# Altium project DIY_BLE_Keyboard.PrjPcb
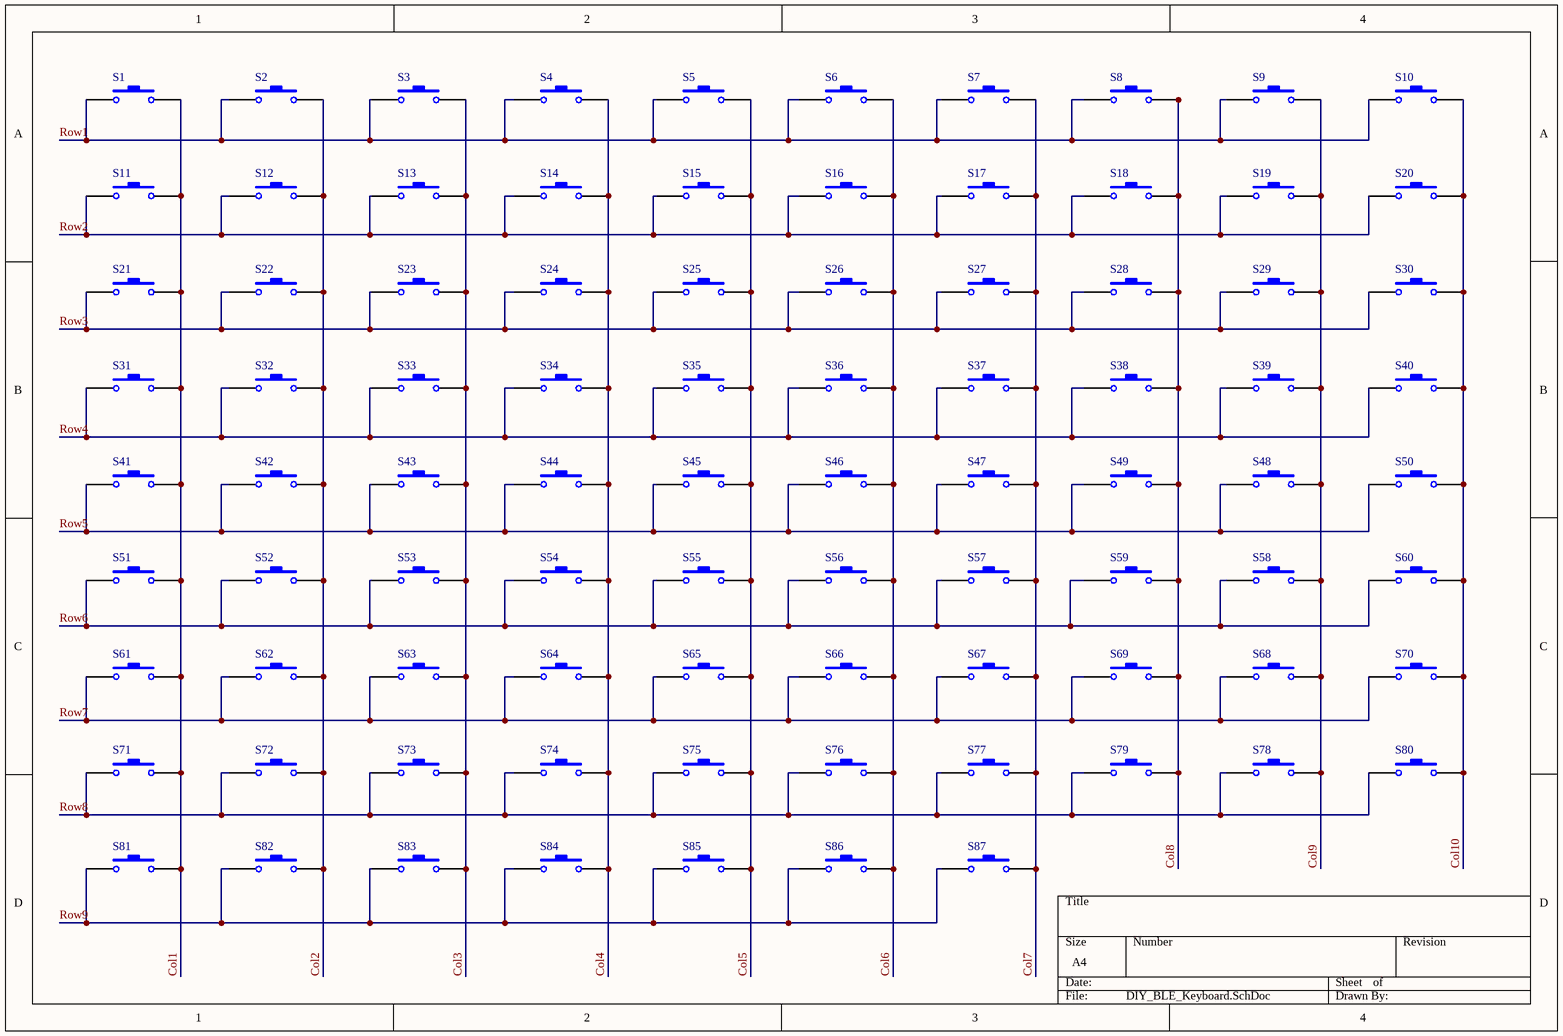
[diagram p0: DIY_BLE_Keyboard.SchDoc]
2 sheets, 119 parts. Net scope: global (net labels, ports and power ports of the same name join across sheets).
Board file: BLE_KB.PcbDoc
Sheets:
  DIY_BLE_Keyboard.SchDoc
  BLE_MCU.SchDoc

## Sheet DIY_BLE_Keyboard.SchDoc
size A4

### Parts
S1  SW-PB  [MX_SW-4]  (value not drawn)
S2  SW-PB  [MX_SW-4]  (value not drawn)
S3  SW-PB  [MX_SW-4]  (value not drawn)
S4  SW-PB  [MX_SW-4]  (value not drawn)
S5  SW-PB  [MX_SW-4]  (value not drawn)
S6  SW-PB  [MX_SW-4]  (value not drawn)
S7  SW-PB  [MX_SW-4]  (value not drawn)
S8  SW-PB  [MX_SW-4]  (value not drawn)
S9  SW-PB  [MX_SW-4]  (value not drawn)
S10  SW-PB  [MX_SW-4]  (value not drawn)
S11  SW-PB  [MX_SW-4]  (value not drawn)
S12  SW-PB  [MX_SW-4]  (value not drawn)
S13  SW-PB  [MX_SW-4]  (value not drawn)
S14  SW-PB  [MX_SW-4]  (value not drawn)
S15  SW-PB  [MX_SW-4]  (value not drawn)
S16  SW-PB  [MX_SW-4]  (value not drawn)
S17  SW-PB  [MX_SW-4]  (value not drawn)
S18  SW-PB  [MX_SW-4]  (value not drawn)
S19  SW-PB  [MX_SW-4]  (value not drawn)
S20  SW-PB  [MX_SW-4]  (value not drawn)
S21  SW-PB  [MX_SW-4]  (value not drawn)
S22  SW-PB  [MX_SW-4]  (value not drawn)
S23  SW-PB  [MX_SW-4]  (value not drawn)
S24  SW-PB  [MX_SW-4]  (value not drawn)
S25  SW-PB  [MX_SW-4]  (value not drawn)
S26  SW-PB  [MX_SW-4]  (value not drawn)
S27  SW-PB  [MX_SW-4]  (value not drawn)
S28  SW-PB  [MX_SW-4]  (value not drawn)
S29  SW-PB  [MX_SW-4]  (value not drawn)
S30  SW-PB  [MX_SW-4]  (value not drawn)
S31  SW-PB  [MX_SW-4]  (value not drawn)
S32  SW-PB  [MX_SW-4]  (value not drawn)
S33  SW-PB  [MX_SW-4]  (value not drawn)
S34  SW-PB  [MX_SW-4]  (value not drawn)
S35  SW-PB  [MX_SW-4]  (value not drawn)
S36  SW-PB  [MX_SW-4]  (value not drawn)
S37  SW-PB  [MX_SW-4]  (value not drawn)
S38  SW-PB  [MX_SW-4]  (value not drawn)
S39  SW-PB  [MX_SW-4]  (value not drawn)
S40  SW-PB  [MX_SW-4]  (value not drawn)
S41  SW-PB  [MX_SW-4]  (value not drawn)
S42  SW-PB  [MX_SW-4]  (value not drawn)
S43  SW-PB  [MX_SW-4]  (value not drawn)
S44  SW-PB  [MX_SW-4]  (value not drawn)
S45  SW-PB  [MX_SW-4]  (value not drawn)
S46  SW-PB  [MX_SW-4]  (value not drawn)
S47  SW-PB  [MX_SW-4]  (value not drawn)
S48  SW-PB  [MX_SW-4]  (value not drawn)
S49  SW-PB  [MX_SW-4]  (value not drawn)
S50  SW-PB  [MX_SW-4]  (value not drawn)
S51  SW-PB  [MX_SW-4]  (value not drawn)
S52  SW-PB  [MX_SW-4]  (value not drawn)
S53  SW-PB  [MX_SW-4]  (value not drawn)
S54  SW-PB  [MX_SW-4]  (value not drawn)
S55  SW-PB  [MX_SW-4]  (value not drawn)
S56  SW-PB  [MX_SW-4]  (value not drawn)
S57  SW-PB  [MX_SW-4]  (value not drawn)
S58  SW-PB  [MX_SW-4]  (value not drawn)
S59  SW-PB  [MX_SW-4]  (value not drawn)
S60  SW-PB  [MX_SW-4]  (value not drawn)
S61  SW-PB  [MX_SW-4]  (value not drawn)
S62  SW-PB  [MX_SW-4]  (value not drawn)
S63  SW-PB  [MX_SW-4]  (value not drawn)
S64  SW-PB  [MX_SW-4]  (value not drawn)
S65  SW-PB  [MX_SW-4]  (value not drawn)
S66  SW-PB  [MX_SW-4]  (value not drawn)
S67  SW-PB  [MX_SW-4]  (value not drawn)
S68  SW-PB  [MX_SW-4]  (value not drawn)
S69  SW-PB  [MX_SW-4]  (value not drawn)
S70  SW-PB  [MX_SW-4]  (value not drawn)
S71  SW-PB  [MX_SW-4]  (value not drawn)
S72  SW-PB  [MX_SW-4]  (value not drawn)
S73  SW-PB  [MX_SW-4]  (value not drawn)
S74  SW-PB  [MX_SW-4]  (value not drawn)
S75  SW-PB  [MX_SW-4]  (value not drawn)
S76  SW-PB  [MX_SW-4]  (value not drawn)
S77  SW-PB  [MX_SW-4]  (value not drawn)
S78  SW-PB  [MX_SW-4]  (value not drawn)
S79  SW-PB  [MX_SW-4]  (value not drawn)
S80  SW-PB  [MX_SW-4]  (value not drawn)
S81  SW-PB  [MX_SW-4]  (value not drawn)
S82  SW-PB  [MX_SW-4]  (value not drawn)
S83  SW-PB  [MX_SW-4]  (value not drawn)
S84  SW-PB  [MX_SW-4]  (value not drawn)
S85  SW-PB  [MX_SW-4]  (value not drawn)
S86  SW-PB  [MX_SW-4]  (value not drawn)
S87  SW-PB  [MX_SW-4]  (value not drawn)

### Nets
Col1: S1.2 S11.2 S21.2 S31.2 S41.2 S51.2 S61.2 S71.2 S81.2
Col2: S2.2 S12.2 S22.2 S32.2 S42.2 S52.2 S62.2 S72.2 S82.2
Col3: S3.2 S13.2 S23.2 S33.2 S43.2 S53.2 S63.2 S73.2 S83.2
Col4: S4.2 S14.2 S24.2 S34.2 S44.2 S54.2 S64.2 S74.2 S84.2
Col5: S5.2 S15.2 S25.2 S35.2 S45.2 S55.2 S65.2 S75.2 S85.2
Col6: S6.2 S16.2 S26.2 S36.2 S46.2 S56.2 S66.2 S76.2 S86.2
Col7: S7.2 S17.2 S27.2 S37.2 S47.2 S57.2 S67.2 S77.2 S87.2
Col8: S8.2 S18.2 S28.2 S38.2 S49.2 S59.2 S69.2 S79.2
Col9: S9.2 S19.2 S29.2 S39.2 S48.2 S58.2 S68.2 S78.2
Col10: S10.2 S20.2 S30.2 S40.2 S50.2 S60.2 S70.2 S80.2
Row1: S1.1 S2.1 S3.1 S4.1 S5.1 S6.1 S7.1 S8.1 S9.1 S10.1
Row2: S11.1 S12.1 S13.1 S14.1 S15.1 S16.1 S17.1 S18.1 S19.1 S20.1
Row3: S21.1 S22.1 S23.1 S24.1 S25.1 S26.1 S27.1 S28.1 S29.1 S30.1
Row4: S31.1 S32.1 S33.1 S34.1 S35.1 S36.1 S37.1 S38.1 S39.1 S40.1
Row5: S41.1 S42.1 S43.1 S44.1 S45.1 S46.1 S47.1 S48.1 S49.1 S50.1
Row6: S51.1 S52.1 S53.1 S54.1 S55.1 S56.1 S57.1 S58.1 S59.1 S60.1
Row7: S61.1 S62.1 S63.1 S64.1 S65.1 S66.1 S67.1 S68.1 S69.1 S70.1
Row8: S71.1 S72.1 S73.1 S74.1 S75.1 S76.1 S77.1 S78.1 S79.1 S80.1
Row9: S81.1 S82.1 S83.1 S84.1 S85.1 S86.1 S87.1

### Library data of the parts
S1-S87 = SW-PB: Switch; Published: 24-Mar-1999; LatestRevisionDate: 17-Jul-2002; LatestRevisionNote: Re-released for DXP Platform.; PackageReference: SPST-2; Publisher: Altium Limited; PackageDescription: Switch; 2 Leads

## Sheet BLE_MCU.SchDoc
size A4
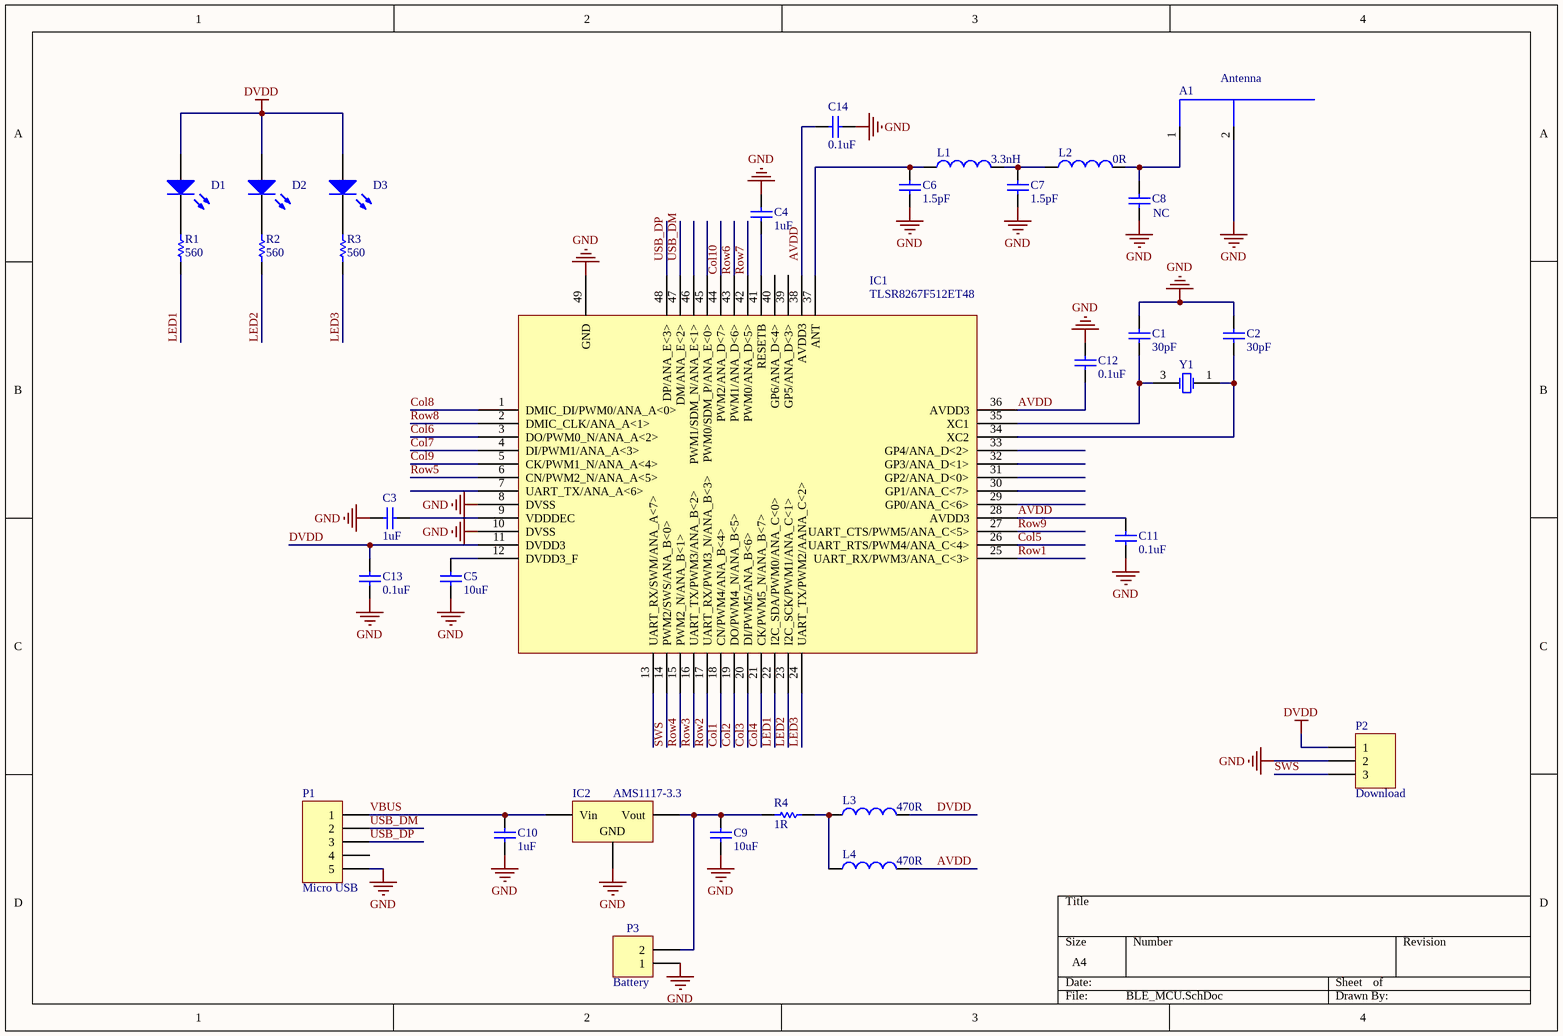
[diagram p1: BLE_MCU.SchDoc]

### Parts
A1  Antenna  [ANT_IFA_TI_DN0007]
C1  value 30pF  [C603_4MOD]  (hidden comment: Cap)
C2  value 30pF  [C603_4MOD]  (hidden comment: Cap)
C3  value 1uF  [C603_4MOD]  (hidden comment: Cap)
C4  value 1uF  [C603_4MOD]  (hidden comment: Cap)
C5  value 10uF  [L0805_POWER_4MOD]  (hidden comment: Cap)
C6  value 1.5pF  [C402_4MOD]  (hidden comment: Cap)
C7  value 1.5pF  [C402_4MOD]  (hidden comment: Cap)
C8  NC  [C402_4MOD]
C9  value 10uF  [L0805_POWER_4MOD]  (hidden comment: Cap)
C10  value 1uF  [C603_4MOD]  (hidden comment: Cap)
C11  value 0.1uF  [C603_4MOD]  (hidden comment: Cap)
C12  value 0.1uF  [C603_4MOD]  (hidden comment: Cap)
C13  value 0.1uF  [C603_4MOD]  (hidden comment: Cap)
C14  value 0.1uF  [C603_4MOD]  (hidden comment: Cap)
D1  LED2  [3.8mm]  (value not drawn)
D2  LED2  [3.8mm]  (value not drawn)
D3  LED2  [3.8mm]  (value not drawn)
IC1  TLSR8267F512ET48  [CC26XX_QFN48(7X7)_0P5]
IC2  AMS1117-3.3  [SOT-223]
L1  value 3.3nH  [L0402_4MOD]  (hidden comment: Inductor)
L2  value 0R  [L0402_4MOD]  (hidden comment: Inductor)
L3  value 470R  [L0805_POWER_4MOD]  (hidden comment: Inductor)
L4  value 470R  [L0805_POWER_4MOD]  (hidden comment: Inductor)
P1  Micro USB  [MICROUSB]
P2  Download  [SWS]
P3  Battery  [HDR1X2]
R1  value 560  [L0805_POWER_4MOD]  (hidden comment: Res1)
R2  value 560  [L0805_POWER_4MOD]  (hidden comment: Res1)
R3  value 560  [L0805_POWER_4MOD]  (hidden comment: Res1)
R4  value 1R  [L0805_POWER_4MOD]  (hidden comment: Res1)
Y1  XTAL  [XTAL_SMD_3225(3.2X2.5)]  (value not drawn)

### Nets
DVDD: C13.1 D1.1(A) D2.1(A) D3.1(A) IC1.11(DVDD3) L3.2 P2.1
GND: A1.2(GND) C1.2 C2.2 C3.2 C4.1 C5.2 C6.2 C7.2 C8.2 C9.2 C10.2 C11.2 C12.1 C13.2 C14.2 IC1.8(DVSS) IC1.10(DVSS) IC1.49(GND) IC2.1(GND) P1.5 P2.2 P3.1
AVDD: C11.1 C12.2 C14.1 IC1.28(AVDD3) IC1.36(AVDD3) IC1.38(AVDD3) L4.2
Col1: IC1.18(CN/PWM4/ANA_B<4>)
Col2: IC1.19(DO/PWM4_N/ANA_B<5>)
Col3: IC1.20(DI/PWM5/ANA_B<6>)
Col4: IC1.21(CK/PWM5_N/ANA_B<7>)
Col5: IC1.26(UART_RTS/PWM4/ANA_C<4>)
Col6: IC1.3(DO/PWM0_N/ANA_A<2>)
Col7: IC1.4(DI/PWM1/ANA_A<3>)
Col8: IC1.1(DMIC_DI/PWM0/ANA_A<0>)
Col9: IC1.5(CK/PWM1_N/ANA_A<4>)
Col10: IC1.44(PWM2/ANA_D<7>)
LED1: IC1.22(I2C_SDA/PWM0/ANA_C<0>) R1.1
LED2: IC1.23(I2C_SCK/PWM1/ANA_C<1>) R2.1
LED3: IC1.24(UART_TX/PWM2/AANA_C<2>) R3.1
Row1: IC1.25(UART_RX/PWM3/ANA_C<3>)
Row2: IC1.17(UART_RX/PWM3_N/ANA_B<3>)
Row3: IC1.16(UART_TX/PWM3/ANA_B<2>)
Row4: IC1.15(PWM2_N/ANA_B<1>)
Row5: IC1.6(CN/PWM2_N/ANA_A<5>)
Row6: IC1.43(PWM1/ANA_D<6>)
Row7: IC1.42(PWM0/ANA_D<5>)
Row8: IC1.2(DMIC_CLK/ANA_A<1>)
Row9: IC1.27(UART_CTS/PWM5/ANA_C<5>)
SWS: IC1.14(PWM2/SWS/ANA_B<0>) P2.3
USB_DM: IC1.47(DM/ANA_E<2>) P1.2
USB_DP: IC1.48(DP/ANA_E<3>) P1.3
VBUS: C10.1 IC2.3(Vin) P1.1
NetA1_1: A1.1(Antenna) C8.1 L2.2
NetC1_1: C1.1 IC1.35(XC1) Y1.3(OSC2)
NetC2_1: C2.1 IC1.34(XC2) Y1.1(OSC1)
NetC3_1: C3.1 IC1.9(VDDDEC)
NetC4_2: C4.2 IC1.41(RESETB)
NetC5_1: C5.1 IC1.12(DVDD3_F)
NetC6_1: C6.1 IC1.37(ANT) L1.1
NetC7_1: C7.1 L1.2 L2.1
NetC9_1: C9.1 IC2.2(Vout) P3.2 R4.2
NetD1_2: D1.2(K) R1.2
NetD2_2: D2.2(K) R2.2
NetD3_2: D3.2(K) R3.2
NetL3_1: L3.1 L4.1 R4.1

Not connected (* = marked no-connect by the designer): IC1 7(UART_TX/ANA_A<6>) 13(UART_RX/SWM/ANA_A<7>) 29(GP0/ANA_C<6>) 30(GP1/ANA_C<7>) 31(GP2/ANA_D<0>) 32(GP3/ANA_D<1>) 33(GP4/ANA_D<2>) 39(GP5/ANA_D<3>) 40(GP6/ANA_D<4>) 45(PWM0/SDM_P/ANA_E<0>) 46(PWM1/SDM_N/ANA_E<1>); P1 4

### Library data of the parts
C1-C7 C9-C14 = Cap: Capacitor; Published: 8-Jun-2000; LatestRevisionDate: 17-Jul-2002; LatestRevisionNote: Re-released for DXP Platform.; PackageReference: RAD-0.3; Publisher: Altium Limited; PackageDescription: Radial Cap, Thru-Hole; 2 Leads; 0.3 in Pin Spacing
C8 = Cap: Capacitor; Value: 1.5pF; Published: 8-Jun-2000; LatestRevisionDate: 17-Jul-2002; LatestRevisionNote: Re-released for DXP Platform.; PackageReference: RAD-0.3; Publisher: Altium Limited; PackageDescription: Radial Cap, Thru-Hole; 2 Leads; 0.3 in Pin Spacing
D1-D3 = LED2: Typical RED, GREEN, YELLOW, AMBER GaAs LED; Published: 8-Jun-2000; LatestRevisionDate: 17-Jul-2002; LatestRevisionNote: Re-released for DXP Platform.; PackageVersion: Feb-2002; PackageReference: 3.2X1.6X1.1; Publisher: Altium Limited; PackageDescription: SM LED; 2 Flat Leads
IC2 = Volt Reg: Voltage Regulator; Published: 24-Mar-1999; LatestRevisionDate: 29-May-2009; LatestRevisionNote: IPC-7351 Footprint Added.; PackageReference: D2PAK; Publisher: Altium Limited; PackageDescription: 3-Pin Transistor Outline Package 2.54 mm Pitch, 15.1 mm Lead Span
L1-L4 = Inductor: Code_IEC: 1005; Published: 8-Jun-2000; LatestRevisionDate: 29-May-2009; LatestRevisionNote: IPC-7351 Footprint Added.; PackageReference: 0402-A; Publisher: Altium Limited; PackageDescription: Chip Inductor; Code_JEITA: 0402
P1 = MHDR1X5: Header, 5-Pin; LatestRevisionDate: 17-Jul-2002; LatestRevisionNote: Re-released for DXP Platform.; Publisher: Altium Limited
P2 = Header 3: Header, 3-Pin; LatestRevisionDate: 17-Jul-2002; LatestRevisionNote: Re-released for DXP Platform.; Publisher: Altium Limited
P3 = Header 2: Header, 2-Pin; LatestRevisionDate: 17-Jul-2002; LatestRevisionNote: Re-released for DXP Platform.; Publisher: Altium Limited
R1-R4 = Res1: Resistor; Published: 8-Jun-2000; LatestRevisionDate: 17-Jul-2002; LatestRevisionNote: Re-released for DXP Platform.; PackageReference: AXIAL-0.3; Publisher: Altium Limited; PackageDescription: Axial Device, Thru-Hole; 2 Leads; 0.3 in Pin Spacing
Y1 = XTAL: Crystal Oscillator; Published: 8-Jun-2000; LatestRevisionDate: 17-Jul-2002; LatestRevisionNote: Re-released for DXP Platform.; PackageReference: R38; Publisher: Altium Limited; PackageDescription: Crystal, Thru-Hole; 2 Leads; Body 3.1 x 8.2 mm (Dia.xH)

## Nets that join several sheets
Col1: DIY_BLE_Keyboard (9 pins), BLE_MCU (IC1.18)
Col2: DIY_BLE_Keyboard (9 pins), BLE_MCU (IC1.19)
Col3: DIY_BLE_Keyboard (9 pins), BLE_MCU (IC1.20)
Col4: DIY_BLE_Keyboard (9 pins), BLE_MCU (IC1.21)
Col5: DIY_BLE_Keyboard (9 pins), BLE_MCU (IC1.26)
Col6: DIY_BLE_Keyboard (9 pins), BLE_MCU (IC1.3)
Col7: DIY_BLE_Keyboard (9 pins), BLE_MCU (IC1.4)
Col8: DIY_BLE_Keyboard (8 pins), BLE_MCU (IC1.1)
Col9: DIY_BLE_Keyboard (8 pins), BLE_MCU (IC1.5)
Col10: DIY_BLE_Keyboard (8 pins), BLE_MCU (IC1.44)
Row1: DIY_BLE_Keyboard (10 pins), BLE_MCU (IC1.25)
Row2: DIY_BLE_Keyboard (10 pins), BLE_MCU (IC1.17)
Row3: DIY_BLE_Keyboard (10 pins), BLE_MCU (IC1.16)
Row4: DIY_BLE_Keyboard (10 pins), BLE_MCU (IC1.15)
Row5: DIY_BLE_Keyboard (10 pins), BLE_MCU (IC1.6)
Row6: DIY_BLE_Keyboard (10 pins), BLE_MCU (IC1.43)
Row7: DIY_BLE_Keyboard (10 pins), BLE_MCU (IC1.42)
Row8: DIY_BLE_Keyboard (10 pins), BLE_MCU (IC1.2)
Row9: DIY_BLE_Keyboard (7 pins), BLE_MCU (IC1.27)